# Altium schematic sheet OpenMPPT2-Power-Stage.SchDoc: =Project + Document
size A4; SheetNumber: 5; SheetTotal: SheetTotaal; Document: Power-Stage
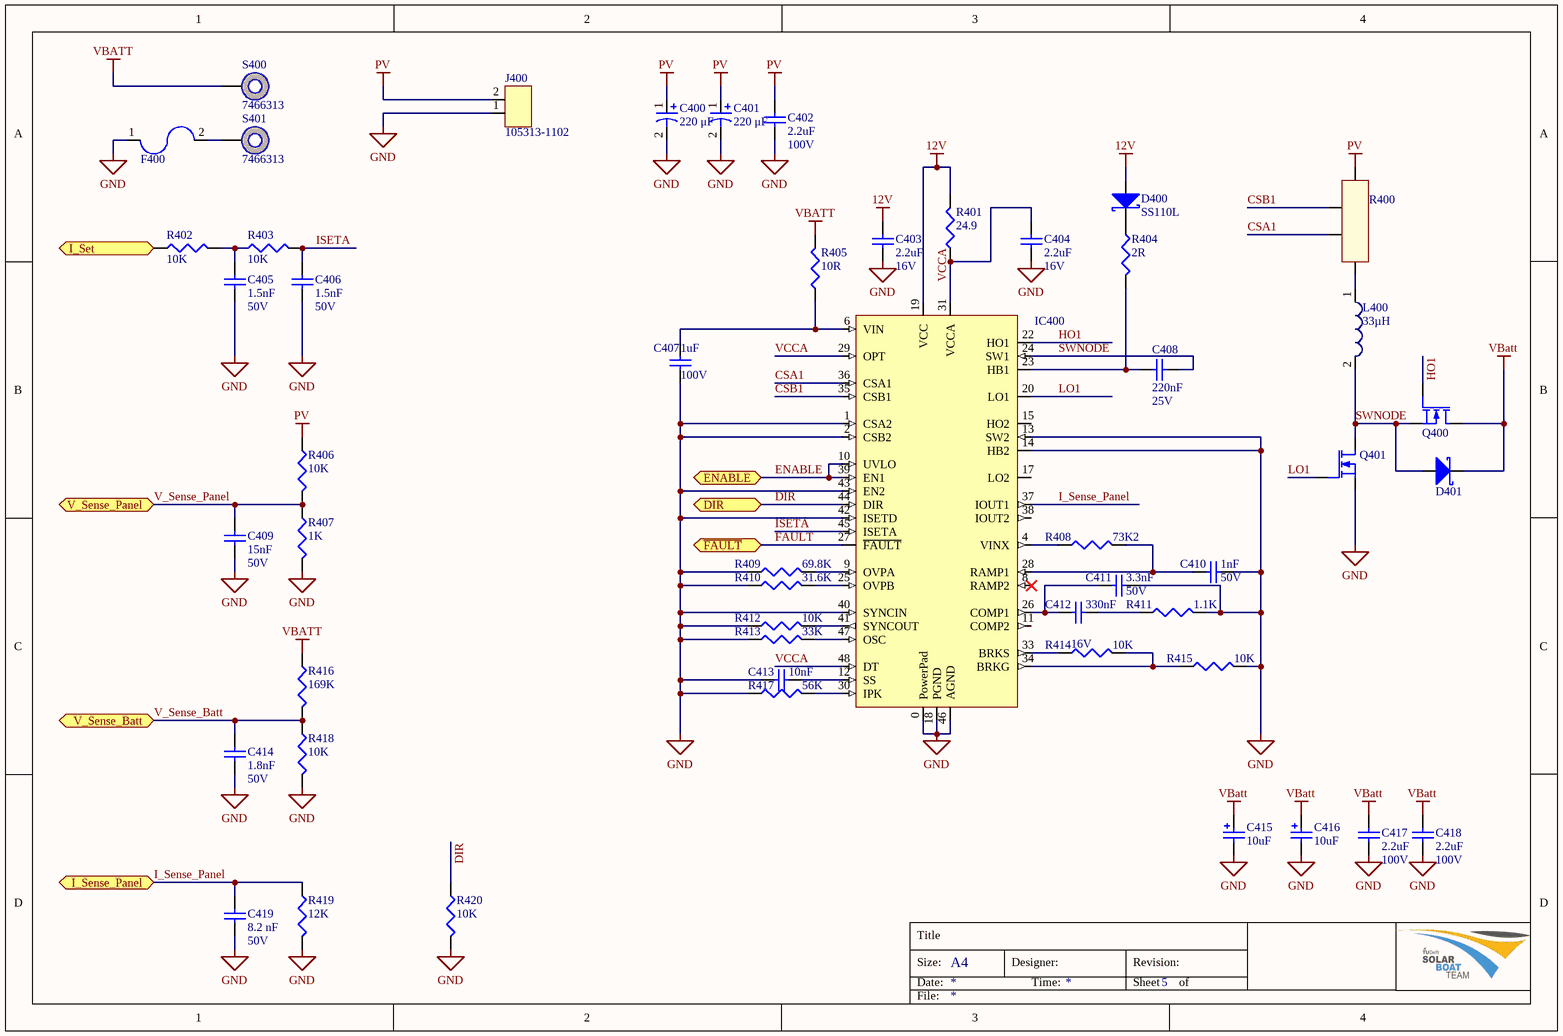
[diagram p0: OpenMPPT2-Power-Stage.SchDoc]

## Parts
C400  220 μF  [WCAP-ATLI 10x16x5x0.6]
C401  220 μF  [WCAP-ATLI 10x16x5x0.6]
C402  2.2uF  Voltage Rating: 100V  [C-1812]
C403  2.2uF  Voltage Rating: 16V  [C-1206]
C404  2.2uF  Voltage Rating: 16V  [C-1206]
C405  1.5nF  Voltage Rating: 50V  [C0603]
C406  1.5nF  Voltage Rating: 50V  [C0603]
C407  1uF  Voltage Rating: 100V  [C-1206]
C408  220nF  Voltage Rating: 25V  [C0603]
C409  15nF  Voltage Rating: 50V  [C0603]
C410  1nF  Voltage Rating: 50V  [C0603]
C411  3.3nF  Voltage Rating: 50V  [C0603]
C412  330nF  Voltage Rating: 16V  [C0603]
C413  10nF  [C0603]
C414  1.8nF  Voltage Rating: 50V  [C0603]
C415  10uF  [WCAP-PTHR_8x11.5x3.5x0.6]
C416  10uF  [WCAP-PTHR_8x11.5x3.5x0.6]
C417  2.2uF  Voltage Rating: 100V  [C-1812]
C418  2.2uF  Voltage Rating: 100V  [C-1812]
C419  8.2 nF  Voltage Rating: 50V  [C0603]
D400  SS110L  [SUB-SMA]
D401  SDT5H100P5-7  [PowerDI5]  (value not drawn)
F400  0154010.DR  [0154010.DR]  (value not drawn)
IC400  LM5170  [TQFP48 - PowerPad]  (value not drawn)
J400  105313-1102  [Nano-Fit 2p RA]
L400  33µH  [WE-HCF 2818]
Q400  PSMN010-80YL  [SOT-669]  (value not drawn)
Q401  PSMN010-80YL  [SOT-669]  (value not drawn)
R400  WSK06125L000FEA  [WSK0612]  (value not drawn)
R401  24.9  [0603]
R402  10K  [0603]
R403  10K  [0603]
R404  2R  [0603]
R405  10R  [0603]
R406  10K  [0603]
R407  1K  [0603]
R408  73K2  [0603]
R409  69.8K  [0603]
R410  31.6K  [0603]
R411  1.1K  [0603]
R412  10K  [0603]
R413  33K  [0603]
R414  10K  [0603]
R415  10K  [0603]
R416  169K  [0603]
R417  56K  [0603]
R418  10K  [0603]
R419  12K  [0603]
R420  10K  [0603]
S400  7466313  [7466313-2]
S401  7466313  [7466313-2]

## Ports
DIR, ENABLE, I_Sense_Panel, I_Set, V_Sense_Batt, V_Sense_Panel, ~{FAULT}

## Nets
12V: C403.2 D400.1(A) IC400.19(VCC) R401.2
GND: C400.2 C401.2 C402.2 C403.1 C404.1 C405.1 C406.1 C407.1 C409.2 C410.2 C411.2 C413.1 C414.2 C415.2(N) C416.2(N) C417.2 C418.2 C419.1 F400.1 IC400.0(PowerPad) IC400.1(CSA2) IC400.2(CSB2) IC400.13(SW2) IC400.14(HB2) IC400.18(PGND) IC400.40(SYNCIN) IC400.42(ISETD) IC400.43(EN2) IC400.46(AGND) J400.1 Q401.S R407.2 R409.1 R410.1 R411.2 R412.1 R413.1 R415.2 R417.1 R418.2 R419.2 R420.2
PV: C400.1 C401.1 C402.1 J400.2 R400.b R406.1
VBATT: C415.1(P) C416.1(P) C417.1 C418.1 D401.K Q400.D R405.2 R416.1 S400.1
CSA1: IC400.36(CSA1) R400.as
CSB1: IC400.35(CSB1) R400.bs
DIR: IC400.44(DIR) R420.1 ; port DIR
ENABLE: IC400.10(UVLO) IC400.39(EN1) ; port ENABLE
~{FAULT}: IC400.27(~{FAULT}) ; port ~{FAULT}
HO1: IC400.22(HO1) Q400.G
I_Sense_Panel: C419.2 IC400.37(IOUT1) R419.1 ; port I_Sense_Panel
I_Set: R402.1 ; port I_Set
ISETA: C406.2 IC400.45(ISETA) R403.2
LO1: IC400.20(LO1) Q401.G
SWNODE: C408.2 D401.A IC400.24(SW1) L400.2 Q400.S Q401.D
V_Sense_Batt: C414.1 R416.2 R418.1 ; port V_Sense_Batt
V_Sense_Panel: C409.1 R406.2 R407.1 ; port V_Sense_Panel
VCCA: C404.2 IC400.29(OPT) IC400.31(VCCA) IC400.48(DT) R401.1
NetC405_2: C405.2 R402.2 R403.1
NetC407_2: C407.2 IC400.6(VIN) R405.1
NetC408_1: C408.1 IC400.23(HB1) R404.2
NetC410_1: C410.1 IC400.28(RAMP1) R408.2
NetC411_1: C411.1 C412.1 IC400.26(COMP1)
NetC412_2: C412.2 R411.1
NetC413_2: C413.2 IC400.12(SS)
NetD400_2: D400.2(K) R404.1
NetF400_2: F400.2 S401.1
NetIC400_4: IC400.4(VINX) R408.1
NetIC400_9: IC400.9(OVPA) R409.2
NetIC400_25: IC400.25(OVPB) R410.2
NetIC400_30: IC400.30(IPK) R417.2
NetIC400_33: IC400.33(BRKS) R414.1
NetIC400_34: IC400.34(BRKG) R414.2 R415.1
NetIC400_41: IC400.41(SYNCOUT) R412.2
NetIC400_47: IC400.47(OSC) R413.2
NetL400_1: L400.1 R400.a

Not connected (* = marked no-connect by the designer): IC400 8(RAMP2)* 11(COMP2) 15(HO2) 17(LO2) 38(IOUT2)

## Notes on the sheet
- Title
- Size:
- Date:
- A4
- Designer:
- Time:
- Revision:
- Sheet
- of
- File:

## Library data of the parts
C400 C401 = WCAP-ATLI 10x16x5x0.6 860080675015: WCAP-ATLI Aluminum Electrolytic Capacitors , 220 μF; + / - 20%; 50 V , 10 x 16; Manufacturer: Wurth Elektronik; E-mail: libraries@we-online.com; Characteristics: Aluminum Electrolytic Capacitor;Recommended soldering: Wave;Operating temperature: –55 °C to +105 °C;Low impedance product series;Load life: 2000–5000 h @ +105 °C; ComponentLink1Description: Manufacturer; ComponentLink1URL: http://www.we-online.com; ComponentLink2Description: Datasheet; ComponentLink2URL: http://katalog.we-online.de/pbs/datasheet/860080675015.pdf; Created by: Karrer Zheng; Created Date: 5/13/2015; Capacitance: 220 μF; Application: Applied to high frequency secondary side output filter loop, general switching power supply, DC-DC converter, AC-DC converter, adapter, charger, TV, VCR, DC motor circuit filter, LCD TV digital audio, digital TV, digital camera, digital video camera, satellite receiver and etc.; partNo: 860080675015
C402 C417 C418 = 2.2uF/1812/CER/100V: Capacitor, 2.2uF, 100V, X7R; Capacitance Tolerance: ± 20%; Capacitor Case Style: 1210; Brand Number: C4532X7R2A225M230KA; Brand: TDK; Dielectric Characteristic: X7R; Capacitance: 2.2uF; Temperature Range: -55°C to +125°C; Price: 0.185; Order Code Supplier: 1843176; Supplier: Farnell
C403 C404 = 2.2uF/1206/CER/16V: Capacitor, 2.2uF, 16V, X7R; Capacitance Tolerance: ± 10%; Capacitor Case Style: 1206; Brand Number: C1206C225K4RACTU; Brand: KEMET; Dielectric Characteristic: X7R; Capacitance: 2.2uF; Temperature Range: -55°C to +125°C; Price: 0,28; Order Code Supplier: 9227911; Supplier: Farnell
C405 C406 = 1.5nF/0603/CER/50V: Capacitor, 1.5pF, 50V, C0G/NP0; Capacitance Tolerance: ± 5%; Capacitor Case Style: 0603; Brand Number: GRM1885C1H152JA01D; Brand: MURATA; Dielectric Characteristic: C0G/NP0; Capacitance: 1.5nF; Temperature Range: -55°C to +125°C; Price: 0,0551; Order Code Supplier: 8819939; Supplier: Farnell
C407 = 1uF/1206/CER/100V: Capacitor, 1uF, 100V, X7R; Capacitance Tolerance: ± 10%; Capacitor Case Style: 1206; Brand Number: 12061C105K4Z2A; Brand: AVX; Dielectric Characteristic: X7R; Capacitance: 1uF; Temperature Range: -55°C to +125°C; Price: 0,52; Order Code Supplier: 1833855; Supplier: Farnell
C408 = 220nF/0603/CER/25V: Capacitor, 220nF, 25V, X7R; Capacitance Tolerance: ± 10%; Capacitor Case Style: 0603; Brand Number: 06033C224KAT2A; Brand: AVX; Dielectric Characteristic: X7R; Capacitance: 220nF; Temperature Range: -55°C to +125°C; Price: 0,111; Order Code Supplier: 320795; Supplier: Farnell
C409 = 15nF/0603/CER/50V: Capacitor, 15nF, 50V, X7R; Capacitance Tolerance: ± 10%; Capacitor Case Style: 0603; Brand Number: 0603B153K500CT; Brand: WALSIN; Dielectric Characteristic: X7R; Capacitance: 15nF; Temperature Range: -55°C to +125°C; Price: 0,0169; Order Code Supplier: 2496840; Supplier: Farnell
C410 = 1nF/0603/CER/50V/C0G: Capacitor, 1nF, 50V, C0G; Dielectric Characteristic: C0G/NP0; Capacitance Tolerance: ± 5%; Capacitor Case Style: 0603; Brand Number: GRM1885C1H102JA01D; Brand: MURATA; Capacitance: 1nF; Temperature Range: -55°C to +125°C; Price: 0,0299; Order Code Supplier: 8819920; Supplier: Farnell
C411 = 3.3nF/0603/CER/50V: Capacitor, 3.3nF, 50V, X7R; Capacitance Tolerance: ± 10%; Capacitor Case Style: 0603; Brand Number: 0603B332K500CT; Brand: WALSIN; Dielectric Characteristic: X7R; Capacitance: 3.3nF; Temperature Range: -55°C to +125°C; Price: 0,0118; Order Code Supplier: 2496853; Supplier: Farnell
C412 = 330nF/0603/CER/16V: Capacitor, 330nF, 16V, X7R; Capacitance Tolerance: ± 10%; Capacitor Case Style: 0603; Brand Number: GRM188R71C334KA01D; Brand: MURATA; Dielectric Characteristic: X7R; Capacitance: 330nF; Temperature Range: -55°C to +125°C; Price: 0,052; Order Code Supplier: 1828892; Supplier: Farnell
C413 = 10nF/0603/CER/50V: Capacitor, 10nF, 50V, X7R; Capacitance Tolerance: ± 10%; Capacitor Case Style: 0603; Brand Number: C0603C103K5RACTU; Brand: KEMET; Dielectric Characteristic: X7R; Capacitance: 10nF; Temperature Range: -55°C to +125°C; Price: 0,011; Order Code Supplier: 1414609; Supplier: Farnell
C414 = 1.8nF/0603/CER/50V: Capacitor, 1.8nF, 50V, X7R; Capacitance Tolerance: ± 10%; Capacitor Case Style: 0603; Brand Number: 0603B182K500CT; Brand: WALSIN; Dielectric Characteristic: X7R; Capacitance: 1.8nF; Temperature Range: -55°C to +125°C; Price: 0,015; Order Code Supplier: 2524826; Supplier: Farnell
C415 C416 = WCAP-PTHR, 870055874001: WCAP-PTHR Aluminum Polymer Capacitors, 10uF; RatedVoltage: 63V; PublishedDate: July 2016; Publisher: Wurth Elektronik; ComponentLink1Description: Manufacturer; ComponentLink1URL: http://www.we-online.de; ComponentLink2Description: Datasheet; ComponentLink2URL: http://katalog.we-online.com/pbs/datasheet/870055874001.pdf; PartNumber: 870055874001; Value: 10uF; Size: 8mmx11.5mm
C419 = 8.2nF/0603/CER/50V: Capacitor, 8.2nF, 50V, X7R; Capacitance Tolerance: ± 10%; Capacitor Case Style: 0603; Brand Number: VJ0603Y822KCAAJ; Brand: VISHAY; Dielectric Characteristic: X7R; Capacitance: 8.2 nF; Temperature Range: -55°C to +125°C; Price: 0,163; Order Code Supplier: 2672789; Supplier: Farnell
D400 = SS110L: Diode Schottky, Vrrm: 100V, If: 1A, Vf: 0.9V; Brand: TAIWAN SEMICONDUCTOR; Case Style: SMF; Brand Number: SS110L; Forward Current: 1A; Forward Voltage: 0.9V; Order Code Supplier: 1559156; Price: 0,191; Supplier: Farnell; Temperature Range: -55°C to +150°C; Vrrm: 100V
D401 = SDT5H100P5-7: Diode Schottky, Vrrm: 100V, If: 5.0A, Vf: 0.62V; Brand: Diodes Incorporated; Brand Number: SDT5H100P5-7; Case Style: PowerDI5; Forward Current: 5.0A; Forward Voltage: 0.62V; Order Code Supplier: 2709573; Price: 0,633; Supplier: Farnell; Temperature Range: -55°C to +150°C; Vrrm: 100V
F400 = 0154010.DR: Miniature SMD Fuse and Holder Assembly, 10A; Supplier: Farnell; Price: 1,53; Order Code Supplier: 2688684; Brand Number: 0154010.DR
IC400 = LM5170: Multiphase Bidirectional Current Controller; Brand: Texas Instruments; Case Style: TQFP-48; Brand Number: LM5170; Supplier: Digi-Key; Order Code Supplier: 296-45255-1-ND; Price: 11,00
J400 = 105313-1102: Molex nano-fit 2 pins connector, single row, right angle; Case Style: 105313; Pitch: 2.5mm; Brand: MOLEX; Brand Number: 105313-1102; Order Code Supplier: 538-105313-1102; Price: 0,672; Supplier: Mouser
L400 = WE-HCF 2818, 7443643300: SMD High Current Inductor WE-HCF, L=33µH; PartNo: 7443643300; Inductance: 33µH; ComponentLink1Description: Manufacturer; ComponentLink1URL: http://www.we-online.de; Created by: Christin Zierenner; Created Date: Oct-2014; ComponentLink2Description: Datasheet; ComponentLink2URL: http://katalog.we-online.de/kataloge/eisos/media/pdf/7443643300.pdf; Supplier: Farnell; Order Code Supplier: 2431617
Q400 Q401 = PSMN010-80YL: Mosfet, N-channel, 80V, 84A, 1.7V, 8.1mohm; Brand: NXP; Gate Source Voltage: 10V; On Resistance: 0.0081ohm; Transistor Polarity: N Channel; Brand Number: PSMN010-80YL; Case Style: SOT-669; Drain Current: 84A; Drain Source Voltage: 80V; Order Code Supplier: 2617065; Price: 0,932; Supplier: Farnell; Temperature Range: -55°C to +150°C; Threshold Voltage: 1.7V
R400 = WSK06125L000FEA: RES, METAL STRIP, 0.005OHM, 1%; Case Style: 0612; Brand: VISHAY; Supplier: Farnell; Price: 0.899; Order Code Supplier: 2420730; Brand Number: WSK06125L000FEA
R401 = 24.9/0603/0100W/75V: Resistor, 24.9R, 1%, 0.1W, 75V, 100PPM, 0603; Brand: VISHAY; Brand Number: CRCW060324R9FKEA.; Case Style: 0603; Order Code Supplier: 2141207; Power Rating: 0.1W; Price: 0,0419; Resistance: 24.9; Supplier: Farnell; Temperature Coefficient: ± 100PPM; Temperature Range: -55°C to +155°C; Voltage Rating: 75V
R402 R403 R406 R412 R414 R415 R418 R420 = 10K/0603/0063W/50V: Resistor, 10K, 1%, 0.063W, 50V, 100PPM, 0603; Brand: MULTICOMP; Brand Number: MC0063W0603110K; Case Style: 0603; Power Rating: 0.063W; Price: 0,038; Resistance: 10K; Supplier: Farnell; Temperature Coefficient: ± 100PPM; Temperature Range: -55°C to +125°C; Voltage Rating: 50V
  R402 R403 R412 R414 R415: Order Code Supplier: 1469748
  R406 R418 R420: Order Code Supplier: 2130939
R404 = 2/0603/0100W/75V: Resistor, 2R, 5%, 0.1W, 75V, 200PPM, 0603; Brand: PANASONIC; Brand Number: ERJ3GEYJ2R0V; Case Style: 0603; Order Code Supplier: 2059531; Power Rating: 0.1W; Price: 0,009; Resistance: 2R; Supplier: Farnell; Temperature Coefficient: ± 200PPM; Temperature Range: -55°C to +125°C; Voltage Rating: 75V
R405 = 10/0603/0125W/50V: Resistor, 10R, 1%, 0.125W, 50V, 200PPM, 0603; Brand: MULTICOMP; Brand Number: MCHP03W8F100JT5E; Case Style: 0603; Order Code Supplier: 1576250; Power Rating: 0.125W; Price: 0,08; Resistance: 10R; Supplier: Farnell; Temperature Coefficient: ± 200PPM; Temperature Range: -55°C to +155°C; Voltage Rating: 50V
R407 = 1K/0603/0063W/50V: Resistor, 1K, 1%, 0.063W, 50V, 100PPM, 0603; Brand: MULTICOMP; Brand Number: MC0063W060311K; Case Style: 0603; Order Code Supplier: 2130855; Power Rating: 0.063W; Price: 0,039; Resistance: 1K; Supplier: Farnell; Temperature Coefficient: ± 100PPM; Temperature Range: -55°C to +125°C; Voltage Rating: 50V
R408 = 73K2/0603/0063W/50V: Resistor, 73K2, 1%, 0.063W, 50V, 100PPM, 0603; Brand: MULTICOMP; Brand Number: CRCW060373K2FKEA; Case Style: 0603; Order Code Supplier: 2138484; Power Rating: 0.063W; Price: 0,0185; Resistance: 73K2; Supplier: Farnell; Temperature Coefficient: ± 100PPM; Temperature Range: -55°C to +125°C; Voltage Rating: 50V
R409 = 69.8K/0603/0100W/100V: Resistor, 69.8K, 0.1%, 0.1W, 100V, 15PPM, 0603; Brand: TE CONNECTIVITY / HOLSWORTHY; Brand Number: RP73D1J69K8BTDG; Temperature Coefficient: ± 100PPM; Case Style: 0603; Order Code Supplier: 1752678; Power Rating: 0.1W; Price: 1,07; Resistance: 69.8K; Supplier: Farnell; Temperature Range: -55°C to +155°C; Voltage Rating: 100V
R410 = 31.6K/0603/0100W/75V: Resistor, 31.6K, 1%, 0.1W, 75V, 100PPM, 0603; Brand: Vishay; Brand Number: CRCW060331K6FKEA.; Case Style: 0603; Order Code Supplier: 2138454; Power Rating: 0.1W; Price: 0,0419; Resistance: 31.6K; Supplier: Farnell; Temperature Coefficient: ± 100PPM; Temperature Range: -55°C to +155°C; Voltage Rating: 75V
R411 = 1.1K/0603/0100W/75V: Resistor, 1.1K, 1%, 0.1W, 75V, 100PPM, 0603; Brand: Vishay; Brand Number: CRCW06031K10FKEA.; Case Style: 0603; Order Code Supplier: 2138353; Power Rating: 0.1W; Price: 0,00419; Resistance: 1.1K; Supplier: Farnell; Temperature Coefficient: ± 100PPM; Temperature Range: -55°C to +155°C; Voltage Rating: 75V
R413 = 33K/0603/0063W/50V: Resistor, 33K, 1%, 0.063W, 50V, 100PPM, 0603; Brand: MULTICOMP; Brand Number: MC 0.063W 0603 1% 33K; Case Style: 0603; Order Code Supplier: 9331034; Power Rating: 0.063W; Price: 0,038; Resistance: 33K; Supplier: Farnell; Temperature Coefficient: ± 100PPM; Temperature Range: -55°C to +125°C; Voltage Rating: 50V
R416 = 169K/0603/0063W/50V: Resistor, 169K, 1%, 0.063W, 50V, 100PPM, 0603; Brand: MULTICOMP; Brand Number: MC 0.063W 0603 1% 169K; Case Style: 0603; Order Code Supplier: 1171007; Power Rating: 0.063W; Price: 0,017; Resistance: 169K; Supplier: Farnell; Temperature Coefficient: ± 100PPM; Temperature Range: -55°C to +125°C; Voltage Rating: 50V
R417 = 56K/0603/0100W/75V: Resistor, 56K, 1%, 0.1W, 75V, 100PPM, 0603; Brand: MULTICOMP; Brand Number: MCSR06X5602FTL; Case Style: 0603; Order Code Supplier: 2138473; Power Rating: 0.1W; Price: 0,0103; Resistance: 56K; Supplier: Farnell; Temperature Coefficient: ± 100PPM; Temperature Range: -55°C to +155°C; Voltage Rating: 75V
R419 = 12K/0603/0063W/50V: Resistor, 12K, 1%, 0.063W, 50V, 100PPM, 0603; Brand: MULTICOMP; Brand Number: MC0063W0603112K; Case Style: 0603; Order Code Supplier: 2130943; Power Rating: 0.063W; Price: 0,0006; Resistance: 12K; Supplier: Farnell; Temperature Coefficient: ± 1%; Temperature Range: -55°C to +125°C; Voltage Rating: 50V
S400 S401 = 7466313: WP-SMRA SMT Right Angle M3 Thread; PublishedDate: Aug 2016; Publisher: Wurth Elektronik; ComponentLink1Description: Manufacturer; ComponentLink1URL: http://www.we-online.de; ComponentLink2Description: Datasheet; PartNumber: 7466313